# EAGLE schematic project (EAGLE 7.7.0)
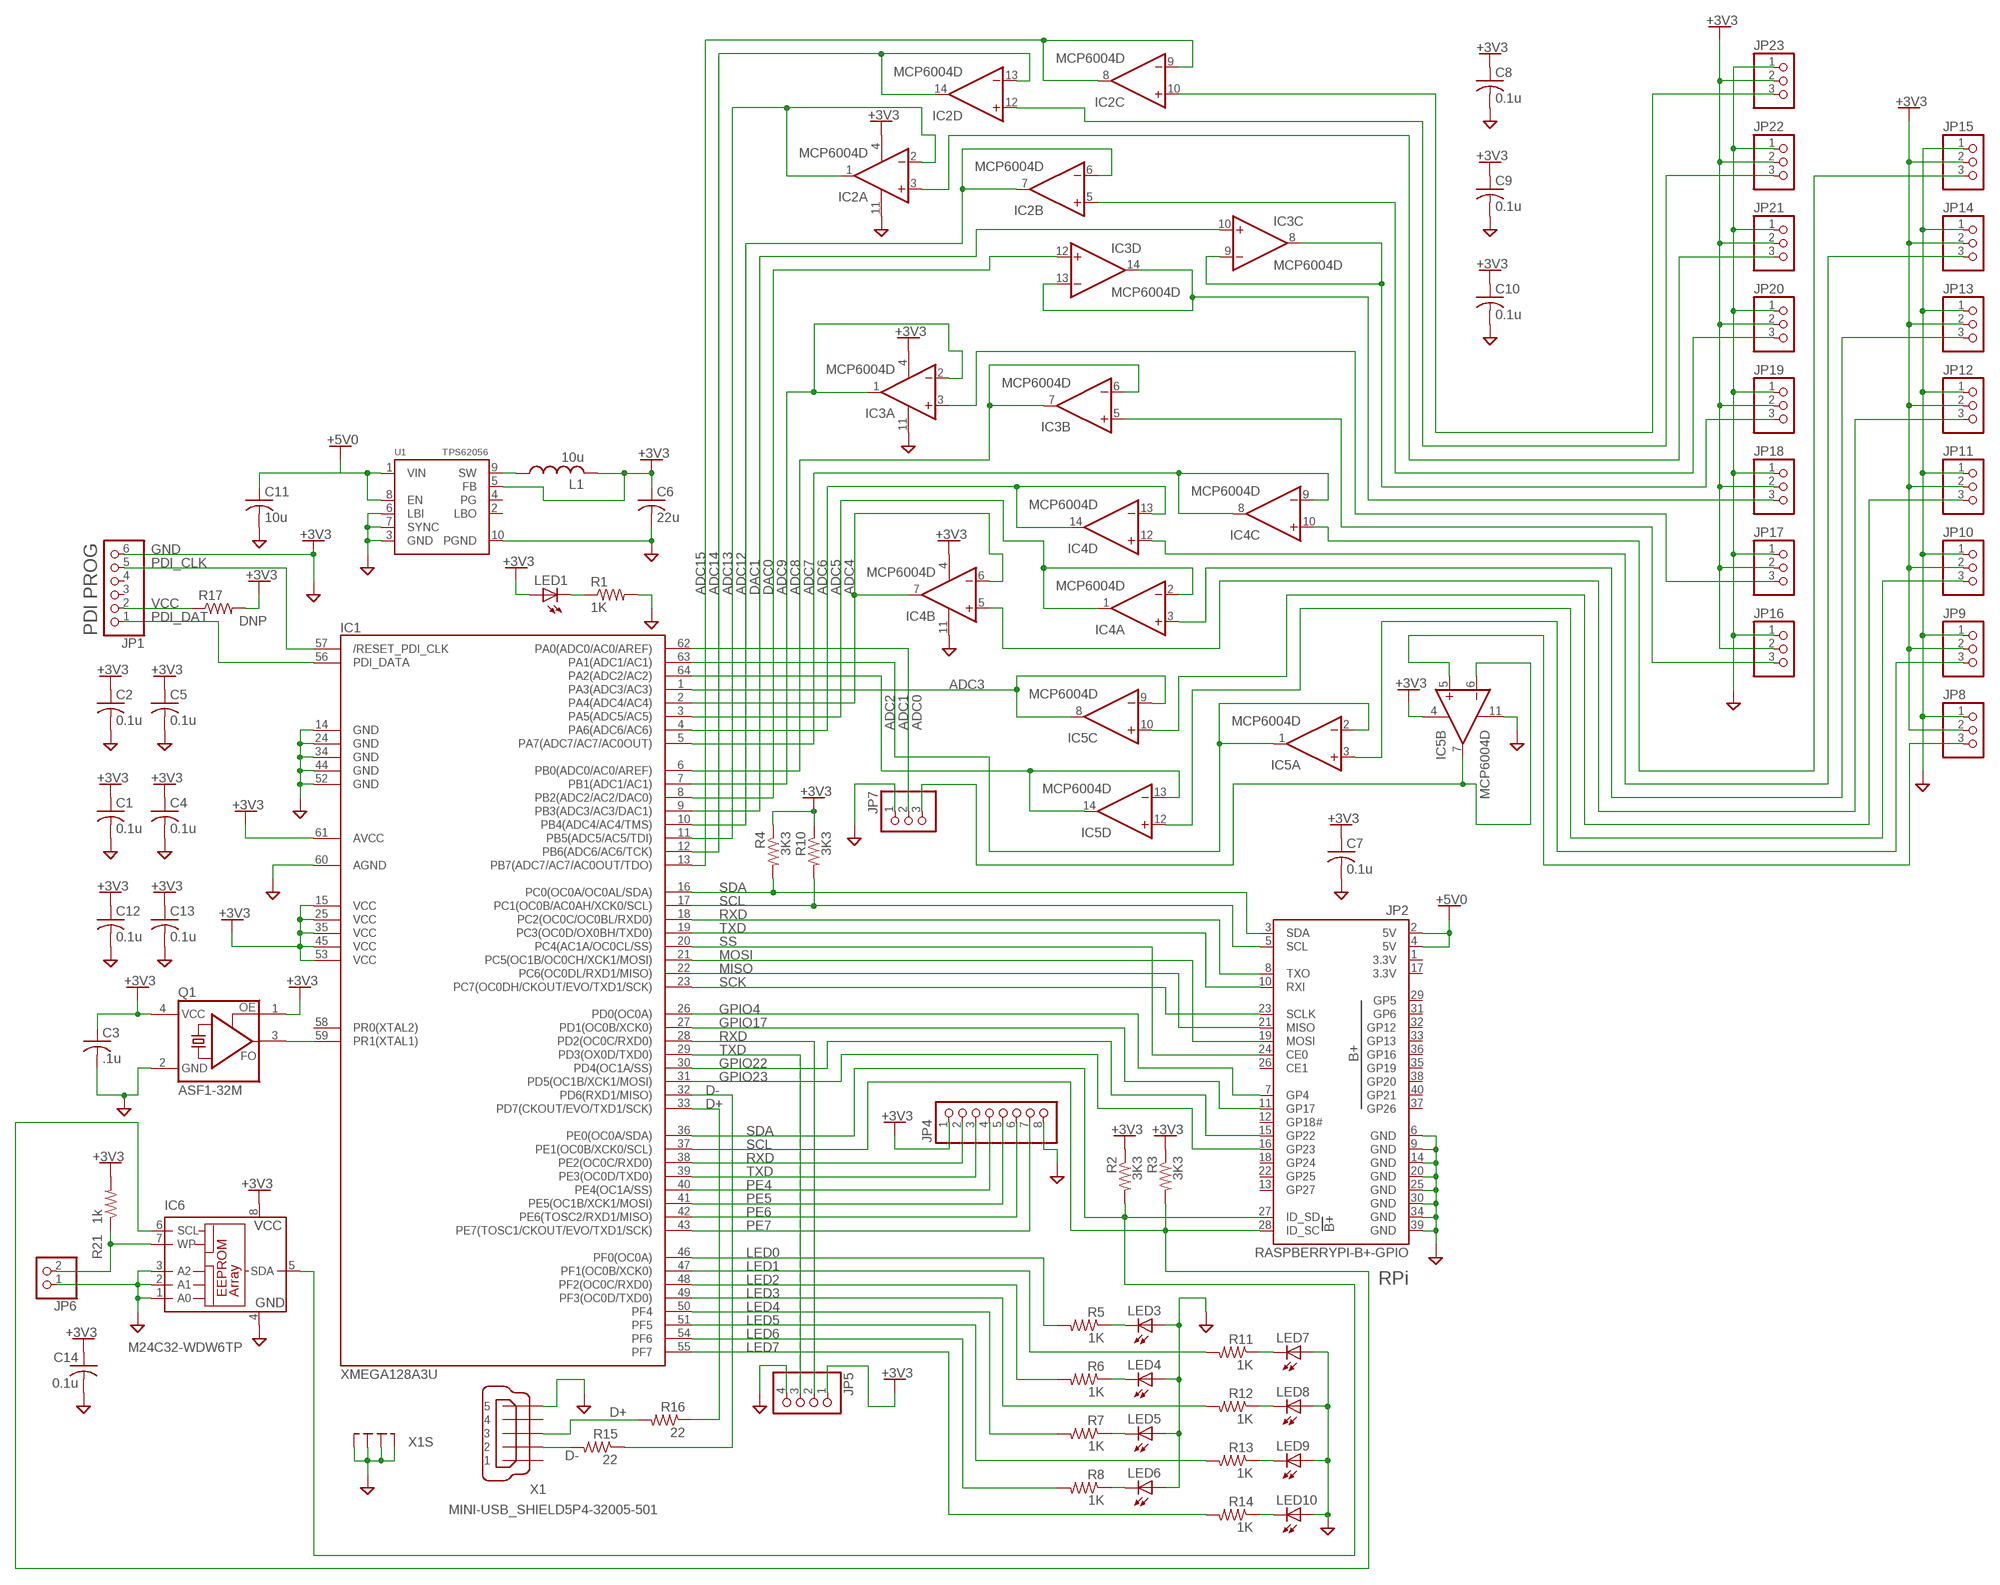
[diagram p0: schematic, sheet 1]

## Parts
C1  0.1u  C-USC0805  [C0805]
C2  0.1u  C-USC0805  [C0805]
C3  .1u  C-USC0805  [C0805]
C4  0.1u  C-USC0805  [C0805]
C5  0.1u  C-USC0805  [C0805]
C6  22u  C-USC0805  [C0805]
C7  0.1u  C-USC0805  [C0805]
C8  0.1u  C-USC0805  [C0805]
C9  0.1u  C-USC0805  [C0805]
C10  0.1u  C-USC0805  [C0805]
C11  10u  C-USC0805  [C0805]
C12  0.1u  C-USC0805  [C0805]
C13  0.1u  C-USC0805  [C0805]
C14  0.1u  C-USC0805  [C0805]
IC1  XMEGA128A3U  XMEGA-A3-AU  [TQFP64_14X14MM]
IC2  MCP6004D  [SO14]
IC3  MCP6004D  [SO14]
IC4  MCP6004D  [SO14]
IC5  MCP6004D  [SO14]
IC6  M24C32-WDW6TP  24C32ASM  [SO-08M]
JP1  PINHD-1X6  [1X06]
JP2  RASPBERRYPI-B+-GPIO  [2X20-SHROUDED]
JP4  PINHD-1X8  [1X08]
JP5  PINHD-1X4  [1X04]
JP6  PINHD-1X2  [1X02]
JP7  PINHD-1X3  [1X03]
JP8  PINHD-1X3  [1X03]
JP9  PINHD-1X3  [1X03]
JP10  PINHD-1X3  [1X03]
JP11  PINHD-1X3  [1X03]
JP12  PINHD-1X3  [1X03]
JP13  PINHD-1X3  [1X03]
JP14  PINHD-1X3  [1X03]
JP15  PINHD-1X3  [1X03]
JP16  PINHD-1X3  [1X03]
JP17  PINHD-1X3  [1X03]
JP18  PINHD-1X3  [1X03]
JP19  PINHD-1X3  [1X03]
JP20  PINHD-1X3  [1X03]
JP21  PINHD-1X3  [1X03]
JP22  PINHD-1X3  [1X03]
JP23  PINHD-1X3  [1X03]
L1  10u  L-US0204/5  [0204/5]
LED1  LED3MM  [LED3MM]
LED3  LED3MM  [LED3MM]
LED4  LED3MM  [LED3MM]
LED5  LED3MM  [LED3MM]
LED6  LED3MM  [LED3MM]
LED7  LED3MM  [LED3MM]
LED8  LED3MM  [LED3MM]
LED9  LED3MM  [LED3MM]
LED10  LED3MM  [LED3MM]
Q1  ASF1-32M  ASF1  [ASF]
R1  1K  R-US_R0603  [R0603]
R2  3K3  R-US_R0603  [R0603]
R3  3K3  R-US_R0603  [R0603]
R4  3K3  R-US_R0603  [R0603]
R5  1K  R-US_R0603  [R0603]
R6  1K  R-US_R0603  [R0603]
R7  1K  R-US_R0603  [R0603]
R8  1K  R-US_R0603  [R0603]
R10  3K3  R-US_R0603  [R0603]
R11  1K  R-US_R0603  [R0603]
R12  1K  R-US_R0603  [R0603]
R13  1K  R-US_R0603  [R0603]
R14  1K  R-US_R0603  [R0603]
R15  22  R-US_R0603  [R0603]
R16  22  R-US_R0603  [R0603]
R17  DNP  R-US_R0603  [R0603]
R21  1k  R-US_R0603  [R0603]
U1  TPS62056  [MSOP10]
X1  MINI-USB_SHIELD5P4-32005-501  [32005-501]

## Nets
+3V3: C1.1 C2.1 C3.1 C4.1 C5.1 C6.1 C7.1 C8.1 C9.1 C10.1 C12.1 C13.1 C14.1 IC1.15(VCC1) IC1.25(VCC2) IC1.35(VCC3) IC1.45(VCC4) IC1.53(VCC5) IC1.61(AVCC) IC2.4(P:V+) IC3.4(P:V+) IC4.4(P:V+) IC5.4(P:V+) IC6.8(VCC) JP1.6 JP4.1 JP5.1 JP8.2 JP9.2 JP10.2 JP11.2 JP12.2 JP13.2 JP14.2 JP15.2 JP16.2 JP17.2 JP18.2 JP19.2 JP20.2 JP21.2 JP22.2 JP23.2 L1.2 LED1.A Q1.1(OE) Q1.4(VCC) R2.1 R3.1 R4.1 R10.1 R17.2 R21.2 U1.5(FB) ; supply symbol labelled GND
+5V0: C11.1 JP2.2(5V) JP2.4(5V) U1.1(VIN) U1.8(EN)
D+: IC1.33(PD7(CKOUT/EVO/TXD1/SCK)) R16.1
D-: IC1.32(PD6(RXD1/MISO)) R15.1
GND: C1.2 C2.2 C3.2 C4.2 C5.2 C6.2 C7.2 C8.2 C9.2 C10.2 C11.2 C12.2 C13.2 C14.2 IC1.14(GND1) IC1.24(GND2) IC1.34(GND3) IC1.44(GND4) IC1.52(GND5) IC1.60(AGND) IC2.11(P:V-) IC3.11(P:V-) IC4.11(P:V-) IC5.11(P:V-) IC6.1(A0) IC6.2(A1) IC6.3(A2) IC6.4(GND) JP2.6(GND) JP2.9(GND) JP2.14(GND) JP2.20(GND) JP2.25(GND) JP2.30(GND) JP2.34(GND) JP2.39(GND) JP4.8 JP5.4 JP6.1 JP7.1 JP8.1 JP9.1 JP10.1 JP11.1 JP12.1 JP13.1 JP14.1 JP15.1 JP16.1 JP17.1 JP18.1 JP19.1 JP20.1 JP21.1 JP22.1 JP23.1 LED3.A LED4.A LED5.A LED6.A LED7.A LED8.A LED9.A LED10.A Q1.2(GND) R1.2 U1.3(GND) U1.6(LBI) U1.7(SYNC) U1.10(PGND) X1.5 X1.M1(S1) X1.M2(S2) X1.M3(S3) X1.M4(S4)
N$1: IC1.59(PR1(XTAL1)) Q1.3(FO)
N$2: IC1.16(PC0(OC0A/OC0AL/SDA)) JP2.3(SDA) R4.2
N$3: IC1.17(PC1(OC0B/AC0AH/XCK0/SCL)) JP2.5(SCL) R10.2
N$4: IC1.18(PC2(OC0C/OC0BL/RXD0)) JP2.8(TXO)
N$5: IC1.19(PC3(OC0D/OX0BH/TXD0)) JP2.10(RXI)
N$6: IC1.23(PC7(OC0DH/CKOUT/EVO/TXD1/SCK)) JP2.23(SCLK)
N$7: IC1.22(PC6(OC0DL/RXD1/MISO)) JP2.21(MISO)
N$8: IC1.21(PC5(OC1B/OC0CH/XCK1/MOSI)) JP2.19(MOSI)
N$9: IC1.20(PC4(AC1A/OC0CL/SS)) JP2.24(CE0)
N$10: JP1.2 R17.1
N$11: IC1.64(PA2(ADC2/AC2)) IC5.13(D:-IN) IC5.14(D:OUT)
N$12: IC1.26(PD0(OC0A)) JP2.7(GP4)
N$13: IC1.27(PD1(OC0B/XCK0)) JP2.11(GP17)
N$14: IC1.30(PD4(OC1A/SS)) JP2.15(GP22)
N$15: IC1.31(PD5(OC1B/XCK1/MOSI)) JP2.16(GP23)
N$16: IC1.36(PE0(OC0A/SDA)) IC6.5(SDA) JP2.27(ID_SD) R2.2
N$17: IC1.37(PE1(OC0B/XCK0/SCL)) IC6.6(SCL) JP2.28(ID_SC) R3.2
N$18: R15.2 X1.2
N$19: IC1.12(PB6(ADC6/AC6/TCK)) IC2.13(D:-IN) IC2.14(D:OUT)
N$20: IC1.11(PB5(ADC5/AC5/TDI)) IC2.1(A:OUT) IC2.2(A:-IN)
N$21: IC1.13(PB7(ADC7/AC7/AC0OUT/TDO)) IC2.8(C:OUT) IC2.9(C:-IN)
N$22: IC1.10(PB4(ADC4/AC4/TMS)) IC2.6(B:-IN) IC2.7(B:OUT)
N$23: IC2.10(C:+IN) JP23.3
N$24: IC2.12(D:+IN) JP22.3
N$25: IC2.3(A:+IN) JP21.3
N$26: IC2.5(B:+IN) JP20.3
N$27: IC3.8(C:OUT) IC3.9(C:-IN) JP19.3
N$28: IC1.9(PB3(ADC3/AC3/DAC1)) IC3.10(C:+IN)
N$29: IC1.7(PB1(ADC1/AC1)) IC3.1(A:OUT) IC3.2(A:-IN)
N$30: IC3.13(D:-IN) IC3.14(D:OUT) JP18.3
N$31: IC3.5(B:+IN) JP16.3
N$32: IC1.8(PB2(ADC2/AC2/DAC0)) IC3.12(D:+IN)
N$33: IC4.12(D:+IN) JP14.3
N$34: IC3.3(A:+IN) JP17.3
N$35: IC1.6(PB0(ADC0/AC0/AREF)) IC3.6(B:-IN) IC3.7(B:OUT)
N$36: R16.2 X1.3
N$37: L1.1 U1.9(SW)
N$38: IC1.4(PA6(ADC6/AC6)) IC4.13(D:-IN) IC4.14(D:OUT)
N$39: IC1.3(PA5(ADC5/AC5)) IC4.1(A:OUT) IC4.2(A:-IN)
N$40: IC1.5(PA7(ADC7/AC7/AC0OUT)) IC4.8(C:OUT) IC4.9(C:-IN)
N$41: IC4.3(A:+IN) JP13.3
N$42: IC4.10(C:+IN) JP15.3
N$43: IC4.5(B:+IN) JP12.3
N$44: IC1.2(PA4(ADC4/AC4)) IC4.6(B:-IN) IC4.7(B:OUT)
N$45: IC6.7(WP) JP6.2 R21.1
N$46: IC1.1(PA3(ADC3/AC3)) IC5.8(C:OUT) IC5.9(C:-IN)
N$47: IC5.3(A:+IN) JP9.3
N$48: IC5.10(C:+IN) JP11.3
N$49: IC1.62(PA0(ADC0/AC0/AREF)) JP7.2
N$50: IC5.12(D:+IN) JP10.3
N$51: IC1.63(PA1(ADC1/AC1)) IC5.1(A:OUT) IC5.2(A:-IN)
N$52: IC5.6(B:-IN) IC5.7(B:OUT) JP7.3
N$53: IC5.5(B:+IN) JP8.3
N$54: IC1.43(PE7(TOSC1/CKOUT/EVO/TXD1/SCK)) JP4.7
N$55: IC1.46(PF0(OC0A)) R5.2
N$56: LED3.K(C) R5.1
N$57: LED4.K(C) R6.1
N$58: IC1.42(PE6(TOSC2/RXD1/MISO)) JP4.6
N$59: LED7.K(C) R11.1
N$61: LED8.K(C) R12.1
N$62: IC1.41(PE5(OC1B/XCK1/MOSI)) JP4.5
N$63: LED5.K(C) R7.1
N$64: IC1.40(PE4(OC1A/SS)) JP4.4
N$65: LED6.K(C) R8.1
N$66: IC1.39(PE3(OC0D/TXD0)) JP4.3
N$67: LED9.K(C) R13.1
N$68: IC1.47(PF1(OC0B/XCK0)) R11.2
N$69: LED10.K(C) R14.1
N$70: IC1.48(PF2(OC0C/RXD0)) R6.2
N$71: IC1.49(PF3(OC0D/TXD0)) R12.2
N$72: IC1.50(PF4) R7.2
N$73: IC1.51(PF5) R13.2
N$74: IC1.54(PF6) R8.2
N$75: IC1.55(PF7) R14.2
N$76: IC1.38(PE2(OC0C/RXD0)) JP4.2
N$77: LED1.K(C) R1.1
N$81: IC1.29(PD3(OX0D/TXD0)) JP5.3
N$82: IC1.28(PD2(OC0C/RXD0)) JP5.2
PDI_CLK: IC1.57(/RESET_PDI_CLK) JP1.5
PDI_DAT: IC1.56(PDI_DATA) JP1.1
Unconnected: IC1.58(PR0(XTAL2)) JP1.3 JP1.4 JP2.12(GP18#) JP2.13(GP27) JP2.18(GP24) JP2.22(GP25) JP2.26(CE1) JP2.29(GP5) JP2.31(GP6) JP2.32(GP12) JP2.33(GP13) JP2.35(GP19) JP2.36(GP16) JP2.37(GP26) JP2.38(GP20) JP2.40(GP21) U1.2(LBO) U1.4(PG) X1.1 X1.4

## Notes on the sheet
- GND
- PDI_CLK
- ADC15 | ADC14 | ADC13 | ADC12 | DAC1 | DAC0 | ADC9 | ADC8 | ADC7 | ADC6 | ADC5 | ADC4
- VCC
- PDI_DAT
- PDI PROG
- ADC3
- ADC2 | ADC1 | ADC0
- SDA
- SCL
- RXD
- TXD
- SS
- MOSI
- MISO
- SCK
- GPIO4
- GPIO17
- RXD
- TXD
- GPIO22
- GPIO23
- D-
- D+
- SDA
- SCL
- RXD
- TXD
- PE4
- PE5
- PE6
- PE7
- LED0
- LED1
- LED2 | RPi
- LED3
- LED4
- LED5
- LED6
- LED7
- D+
- D-

## Power pins joined to a net without a drawn wire
3.3V: JP2.1(3.3V) JP2.17(3.3V)

## Library data of the parts
C1-C14 = rcl:C-US: CAPACITOR, American symbol
IC1 = SparkFun-DigitalIC:XMEGA-A3: Atmel's 8/16-bit AVR XMEGA A3 Microcontroller - ATxmega256A3, etc.
IC2-IC5 = aks:MCP6004: OP AMP
IC6 = aks:24*: Serial EEPROM I2C
JP1 = pinhead:PINHD-1X6: PIN HEADER
JP2 = SparkFun-Boards:RASPBERRYPI-B+-GPIO: Raspberry Pi B+ GPIO Header 2x20 pin connector
JP4 = pinhead:PINHD-1X8: PIN HEADER
JP5 = pinhead:PINHD-1X4: PIN HEADER
JP6 = pinhead:PINHD-1X2: PIN HEADER
JP7-JP23 = pinhead:PINHD-1X3: PIN HEADER
L1 = rcl:L-US: INDUCTOR, American symbol
LED1 LED3-LED10 = led:LED: LED OSRAM: - CHIPLED LG R971, LG N971, LY N971, LG Q971, LY Q971, LO R971, LY R971 LH N974, LH R974 LS Q976, LO Q976, LY Q976 LO Q996 - Hyper CHIPLED LW Q18S LB Q993, LB Q99A, LB R99A - SideLED LS A670, LO A670, LY A670, LG A670, LP A670 LB A673, LV A673, LT A673, LW A673 LH A674 LY A675 LS A676, LA A676, LO A676, LY A676, LW A676 LS A679, LY A679, LG A679 - Hyper Micro SIDELED® LS Y876, LA Y876, LO Y876, LY Y876 LT Y87S - SmartLED LW L88C, LW L88S LB L89C, LB L89S, LG L890 LS L89K, LO L89K, LY L89K LS L896, LA L896, LO L896, LY L896 - TOPLED LS T670, LO T670, LY T670, LG T670, LP T670 LSG T670, LSP T670, LSY T670, LOP T670, LYG T670 LG T671, LOG T671, LSG T671 LB T673, LV T673, LT T673, LW T673 LH T674 LS T676, LA T676, LO T676, LY T676, LB T676, LH T676, LSB T676, LW T676 LB T67C, LV T67C, LT T67C, LS T67K, LO T67K, LY T67K, LW E67C LS E67B, LA E67B, LO E67B, LY E67B, LB E67C, LV E67C, LT E67C LW T67C LS T679, LY T679, LG T679 LS T770, LO T770, LY T770, LG T770, LP T770 LB T773, LV T773, LT T773, LW T773 LH T774 LS E675, LA E675, LY E675, LS T675 LS T776, LA T776, LO T776, LY T776, LB T776 LHGB T686 LT T68C, LB T68C - Hyper Mini TOPLED® LB M676 - Mini TOPLED Santana® LG M470 LS M47K, LO M47K, LY M47K Source: http://www.osram.convergy.de LUXEON: - LUMILED® LXK2-PW12-R00, LXK2-PW12-S00, LXK2-PW14-U00, LXK2-PW14-V00 LXK2-PM12-R00, LXK2-PM12-S00, LXK2-PM14-U00 LXK2-PE12-Q00, LXK2-PE12-R00, LXK2-PE12-S00, LXK2-PE14-T00, LXK2-PE14-U00 LXK2-PB12-K00, LXK2-PB12-L00, LXK2-PB12-M00, LXK2-PB14-N00, LXK2-PB14-P00, LXK2-PB14-Q00 LXK2-PR12-L00, LXK2-PR12-M00, LXK2-PR14-Q00, LXK2-PR14-R00 LXK2-PD12-Q00, LXK2-PD12-R00, LXK2-PD12-S00 LXK2-PH12-R00, LXK2-PH12-S00 LXK2-PL12-P00, LXK2-PL12-Q00, LXK2-PL12-R00 Source: www.luxeon.com KINGBRIGHT: KA-3528ASYC Source: www.kingbright.com
Q1 = crystal:ASF*: CRYSTAL CLOCK OSCILLATORS 5.0 Vdc or 3.3 Vdc - LOW PROFILE ULTRA MINIATURE CERAMIC SURFACE MOUNT Source: http://www.abracon.com/Oscillators/asf1-L-L1.pdf; OC_FARNELL: unknown; OC_NEWARK: unknown
R1-R8 R10-R17 R21 = resistor:R-US_: RESISTOR, American symbol
U1 = aks:TPS62056
X1 = con-cypressindustries:MINI-USB_SHIELD5P4-: MINI USB-B R/A W/O POST 5 pol. Source: www.cypressindustries.com; OC_FARNELL: unknown; OC_NEWARK: unknown